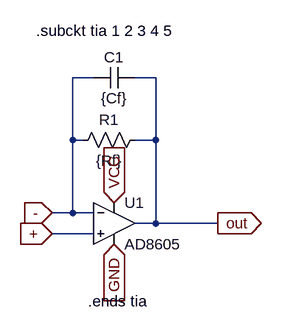
[diagram p0: schematic tia.asc]
tia.asc, the LTspice schematic file:
Version 4
SHEET 1 2352 680
WIRE 304 -160 272 -160
WIRE 400 -160 368 -160
WIRE 272 -64 272 -160
WIRE 288 -64 272 -64
WIRE 400 -64 400 -160
WIRE 400 -64 368 -64
WIRE 272 48 272 -64
WIRE 272 48 240 48
WIRE 304 48 272 48
WIRE 400 64 400 -64
WIRE 400 64 368 64
WIRE 496 64 400 64
WIRE 304 80 240 80
FLAG 240 48 -
IOPIN 240 48 In
FLAG 240 80 +
IOPIN 240 80 In
FLAG 496 64 out
IOPIN 496 64 Out
FLAG 336 96 GND
IOPIN 336 96 In
FLAG 336 32 VCC
IOPIN 336 32 In
SYMBOL OpAmps/AD8605 336 0 R0
SYMATTR InstName U1
SYMBOL Res 384 -80 R90
WINDOW 0 0 56 VBottom 2
WINDOW 3 32 56 VTop 2
SYMATTR InstName R1
SYMATTR Value {Rf}
SYMBOL Cap 368 -176 R90
WINDOW 0 0 32 VBottom 2
WINDOW 3 32 32 VTop 2
SYMATTR InstName C1
SYMATTR Value {Cf}
TEXT 216 -232 Left 2 !.subckt tia 1 2 3 4 5
TEXT 296 184 Left 2 !.ends tia

The netlist it stands for:
* tia.asc
XU1 + - VCC GND out AD8605  ; pins In+ In- V+ V- OUT
R1 out - {Rf}
C1 out - {Cf}
.subckt tia 1 2 3 4 5
.ends tia
.lib ADI.lib
.backanno
.end